# EAGLE schematic carte Rpi (EAGLE 6.1)
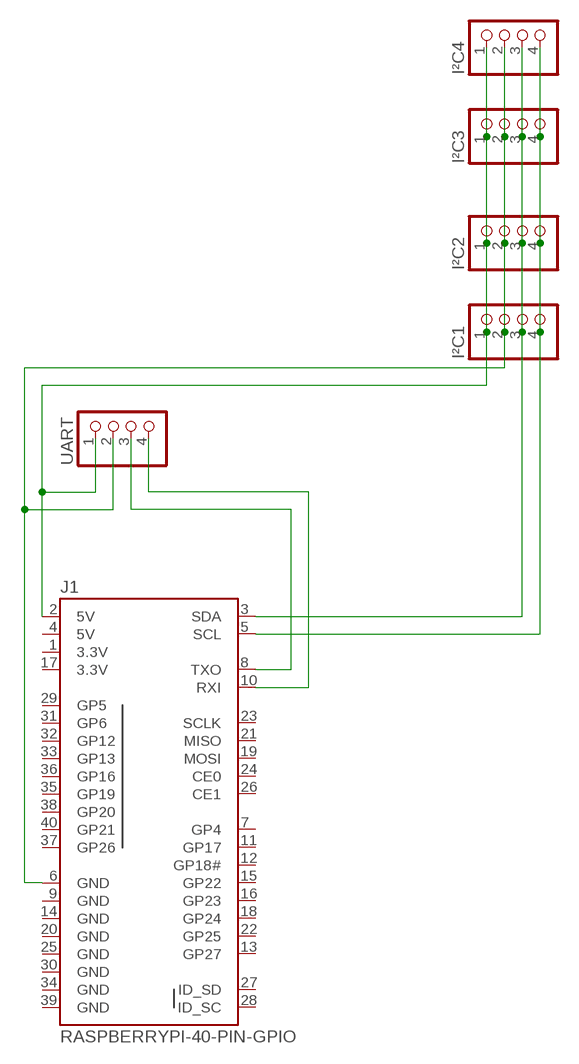
[diagram p0: schematic, sheet 1]

## Parts
I²C1  PINHD-1X4  [1X04]
I²C2  PINHD-1X4  [1X04]
I²C3  PINHD-1X4  [1X04]
I²C4  PINHD-1X4  [1X04]
J1  RASPBERRYPI-40-PIN-GPIO  [2X20-SHROUDED]
UART  PINHD-1X4  [1X04]

## Nets
5V: I²C1.1 I²C2.1 I²C3.1 I²C4.1 J1.2(5V) UART.1
GND: I²C1.2 I²C2.2 I²C3.2 I²C4.2 J1.6(GND) UART.2
RX: J1.10(RXI) UART.4
SCL: I²C1.4 I²C2.4 I²C3.4 I²C4.4 J1.5(SCL)
SDA: I²C1.3 I²C2.3 I²C3.3 I²C4.3 J1.3(SDA)
TX: J1.8(TXO) UART.3
Unconnected: J1.7(GP4) J1.11(GP17) J1.12(GP18#) J1.13(GP27) J1.15(GP22) J1.16(GP23) J1.18(GP24) J1.19(MOSI) J1.21(MISO) J1.22(GP25) J1.23(SCLK) J1.24(CE0) J1.26(CE1) J1.27(ID_SD) J1.28(ID_SC) J1.29(GP5) J1.31(GP6) J1.32(GP12) J1.33(GP13) J1.35(GP19) J1.36(GP16) J1.37(GP26) J1.38(GP20) J1.40(GP21)

## Power pins joined to a net without a drawn wire
3.3V: J1.1(3.3V) J1.17(3.3V)
5V: J1.4(5V)
GND: J1.9(GND) J1.14(GND) J1.20(GND) J1.25(GND) J1.30(GND) J1.34(GND) J1.39(GND)

## Library data of the parts
I²C1-I²C4 UART = pinhead:PINHD-1X4: PIN HEADER
J1 = SparkFun-Boards:RASPBERRYPI-40-PIN-GPIO: Second Generation Raspberry Pi GPIO Header 2x20 pin connector, as found on B, B+, A+ models.